# EAGLE design d_Conventional_3_Level_BC (EAGLE 9.2.1)
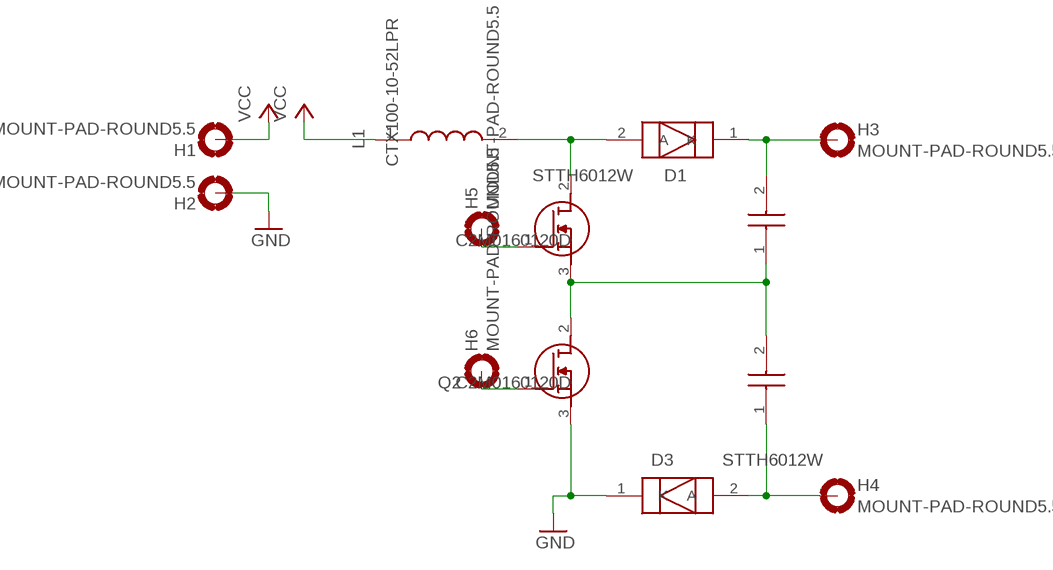
[diagram p0: schematic, sheet 1]

## Parts
D1  STTH6012W  [TO1090P515X1560X2445-2P]
D3  STTH6012W  [TO1090P515X1560X2445-2P]
H1  MOUNT-PAD-ROUND5.5  [5,5-PAD]
H2  MOUNT-PAD-ROUND5.5  [5,5-PAD]
H3  MOUNT-PAD-ROUND5.5  [5,5-PAD]
H4  MOUNT-PAD-ROUND5.5  [5,5-PAD]
H5  MOUNT-PAD-ROUND5.5  [5,5-PAD]
H6  MOUNT-PAD-ROUND5.5  [5,5-PAD]
L1  CTX100-10-52LPR  [CTX1001052LPR]
Q1  C2M0160120D  [TO544P521X1594X2550-3P]
Q2  C2M0160120D  [TO544P521X1594X2550-3P]
U$3  B32774D4505K000  [B32774D4505K000]
U$4  B32774D4505K000  [B32774D4505K000]

## Nets
GND: D3.1(K) H2.B5,5(MOUNT) Q2.3(S)
N$1: Q1.3(S) Q2.2(D) U$3.1 U$4.2
N$2: H5.B5,5(MOUNT) Q1.1(G)
N$3: D1.2(A) L1.2 Q1.2(D)
N$4: D1.1(K) H3.B5,5(MOUNT) U$3.2
N$5: H6.B5,5(MOUNT) Q2.1(G)
N$6: D3.2(A) H4.B5,5(MOUNT) U$4.1
VCC: H1.B5,5(MOUNT) L1.1

## Library data of the parts
D1 D3 = SamacSys_Parts:STTH6012W: STTH6012W, Fast Recovery Rectifier Diode, Switching 60A max, 1200V 125ns, 2-Pin, DO-247 Source: Datasheet <http://www.st.com/web/en/resource/technical/document/datasheet/CD00096472.pdf>; ALLIED_NUMBER: 70014108; ALLIED_PRICE-STOCK: http://www.alliedelec.com/stmicroelectronics-stth6012w/70014108/; ARROW_PART_NUMBER: STTH6012W; ARROW_PRICE-STOCK: https://www.arrow.com/en/products/stth6012w/stmicroelectronics; DESCRIPTION: STTH6012W, Fast Recovery Rectifier Diode, Switching 60A max, 1200V 125ns, 2-Pin, DO-247; HEIGHT: 5.15mm; MANUFACTURER_NAME: STMicroelectronics; MANUFACTURER_PART_NUMBER: STTH6012W; RS_PART_NUMBER: 6870818; RS_PRICE-STOCK: http://uk.rs-online.com/web/p/rectifier-schottky-diodes/6870818/?source=DS
H1-H6 = holes:MOUNT-PAD-ROUND: MOUNTING PAD, round
L1 = SamacSys_Parts:CTX100-10-52LPR: Fixed Inductors 100uH 13A Source: Datasheet <http://www.cooperindustries.com/content/dam/public/bussmann/Electronics/Resources/product-datasheets/Bus_Elx_DS_PM 4304_LPCI_Series.pdf>; ARROW_PART_NUMBER: CTX100-10-52LPR; DESCRIPTION: Fixed Inductors 100uH 13A; HEIGHT: 27.5mm; MANUFACTURER_NAME: Eaton; MANUFACTURER_PART_NUMBER: CTX100-10-52LPR
Q1 Q2 = SamacSys_Parts:C2M0160120D: Wolfspeed C2M0160120D N-channel SiC MOSFET Transistor, 19 A, 1200 V, 3-Pin TO-247 Source: Datasheet <http://www.wolfspeed.com/media/downloads/169/C2M0160120D.pdf>; ARROW_PART_NUMBER: C2M0160120D; ARROW_PRICE-STOCK: http://uk.rs-online.com/web/p/products/1629709; DESCRIPTION: Wolfspeed C2M0160120D N-channel SiC MOSFET Transistor, 19 A, 1200 V, 3-Pin TO-247; HEIGHT: 5.21mm; MANUFACTURER_NAME: Wolfspeed; MANUFACTURER_PART_NUMBER: C2M0160120D; RS_PART_NUMBER: 1629709; RS_PRICE-STOCK: http://uk.rs-online.com/web/p/products/1629709
U$3 U$4 = SamacSys_Parts:B32774D4505K000: Epcos B32774D 5F Polypropylene Film Capacitor 450 V dc 10% Source: Datasheet <https://en.tdk-electronics.tdk.com/inf/20/20/db/fc_2009/MKP_B32774_778.pdf>; ARROW_PART_NUMBER: B32774D4505K000; ARROW_PRICE-STOCK: https://www.arrow.com/en/products/b32774d4505k000/epcos-tdk; DESCRIPTION: Epcos B32774D 5F Polypropylene Film Capacitor 450 V dc 10%; HEIGHT: 21mm; MANUFACTURER_NAME: EPCOS; MANUFACTURER_PART_NUMBER: B32774D4505K000; RS_PART_NUMBER: 1726009; RS_PRICE-STOCK: http://uk.rs-online.com/web/p/products/1726009

## Board
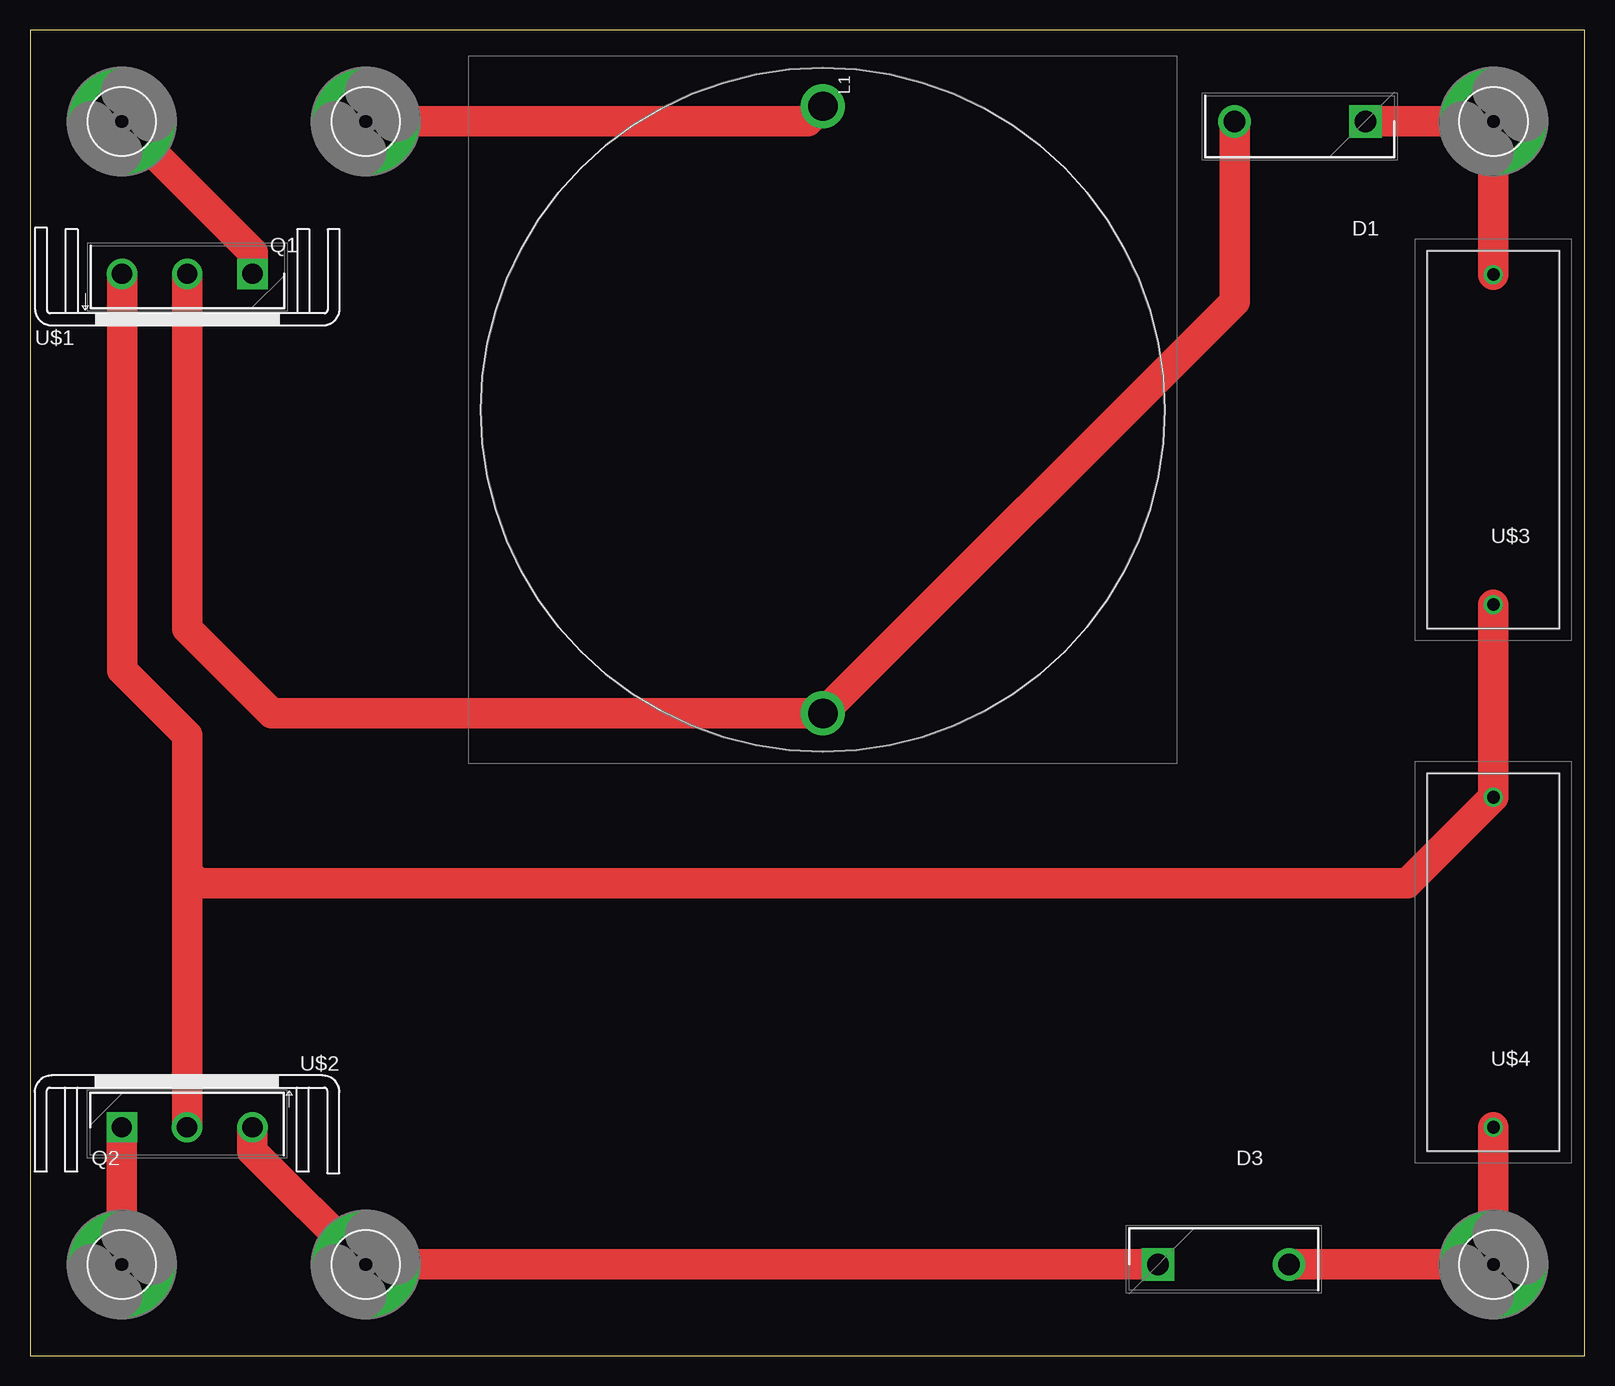
[diagram p1: board, top side]

Size 129.57 x 110.49 mm. Coordinates in mm from the lower left corner, seen from the top.
Outline: 0.01,0 129.57,0 129.57,110.49 0,110.49 0.01,0
Copper layers (1*16): Top 0.035mm / dielectric 1.5mm / Bottom 0.035mm
Design rules "default": minimum track width 6mil, minimum drill 0.35mm, track to track 6mil, track to pad 6mil, pad to pad 6mil, via to via 6mil, smd to smd 6mil, copper to edge 40mil, drill to drill 6mil, minimum pad ring 10mil, minimum via ring 8mil, stop-mask expansion 4mil, vias tented up to drill 0mil, thermal gap 10mil

### Footprints (pad centres in the part's own frame; a part is rotated, then mirrored left to right if it is on the bottom)
TO1090P515X1560X2445-2P = drill 1.81 pad 2.715 square: 1 0,0 | drill 1.81 pad 2.715: 2 10.9,0
5,5-PAD = drill 5.5 pad 9: B5,5 0,0
CTX1001052LPR = drill 2.45 pad 3.675: 1 0,0; 2 50.6,0
TO544P521X1594X2550-3P = drill 1.69 pad 2.535 square: 1 0,0 | drill 1.69 pad 2.535: 2 5.44,0; 3 10.88,0
B32774D4505K000 = drill 1.05 pad 1.575: 1 0,0; 2 27.5,0

### Placement (x,y rotation side)
D1  111.28,102.87 180 top
D3  94.01,7.62 0 top
H1  27.97,102.87 0 top
H2  27.97,7.62 0 top
H3  121.95,102.87 0 top
H4  121.95,7.62 0 top
H5  7.65,102.87 0 top
H6  7.65,7.62 0 top
L1  66.07,104.14 270 top
Q1  18.55,90.17 180 top
Q2  7.65,19.05 0 top
U$1  [FK209]  13.11,86.89 0 top
U$2  [FK209]  13.09,22.35 180 top
U$3  121.95,62.61 90 top
U$4  121.95,19.05 90 top

### Tracks (layer width: path | path; a pad name or v marks a point on that pad's centre or on a via)
GND
  Top 2.54: Q2.3 18.53,17.06 H2.B5,5 D3.1
N$1
  Top 2.54: U$3.1 U$4.2 114.77,39.37 14.02,39.37 13.09,40.3 | 7.67,60.03 Q1.3 7.67,57.15 13.09,51.73 13.09,40.3 | 13.09,40.3 Q2.2
N$2
  Top 2.54: Q1.1 18.55,91.97 H5.B5,5
N$3
  Top 2.54: Q1.2 13.11,60.58 20.15,53.54 L1.2 100.38,87.85 D1.2
N$4
  Top 2.54: U$3.2 H3.B5,5 D1.1
N$5
  Top 2.54: H6.B5,5 Q2.1
N$6
  Top 2.54: U$4.1 H4.B5,5 D3.2
VCC
  Top 2.54: L1.1 64.8,102.87 H1.B5,5